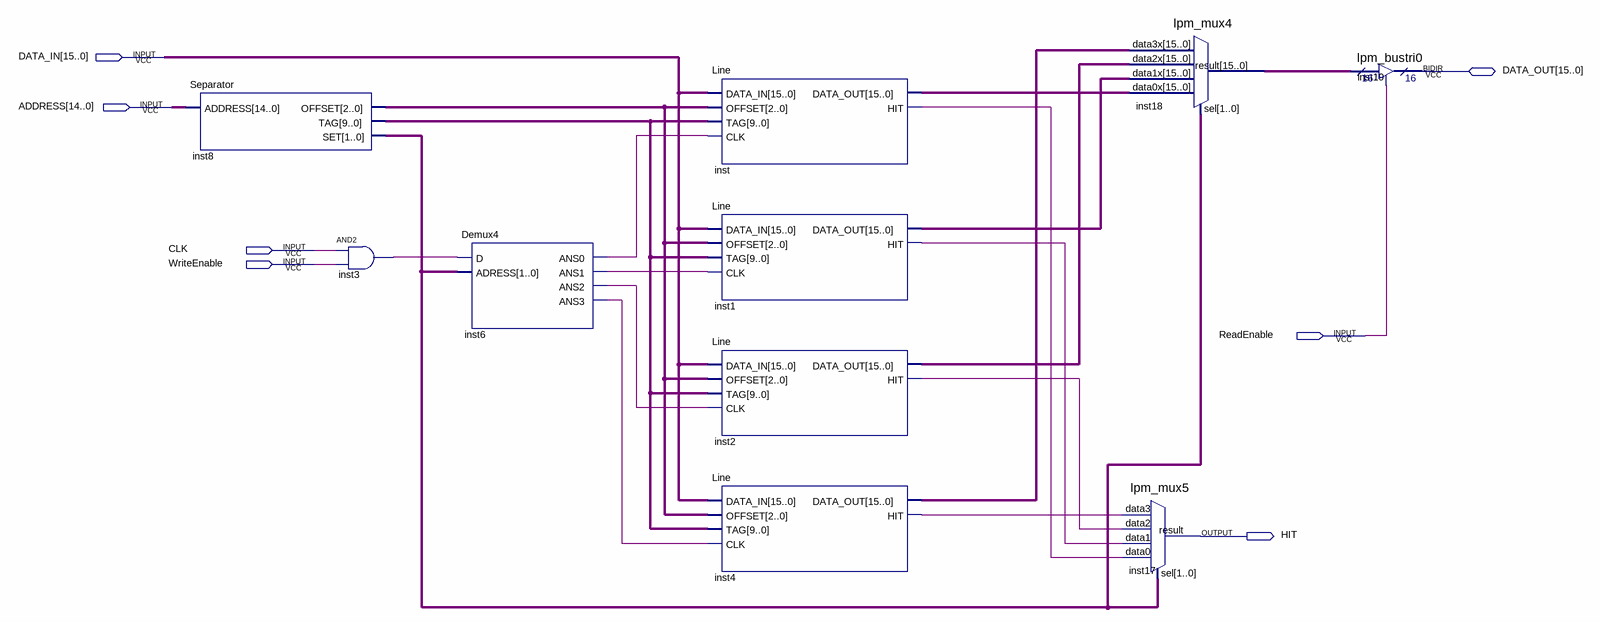
[diagram p0: schematic sheet]
// Quartus schematic Cache.bdf as structural Verilog: 10 symbols, 7 pins
module Cache (
  input  [15:0] DATA_IN,
  input  [14:0] ADDRESS,
  input  CLK,
  input  WriteEnable,
  input  ReadEnable,
  inout  [15:0] DATA_OUT,
  output HIT
);

  wire inst1_hit, inst2_hit, inst3_out, inst4_hit, inst6_ans0, inst6_ans1, inst6_ans2, inst6_ans3, inst_hit;
  wire [1:0] inst8_set;
  wire [2:0] inst8_offset;
  wire [9:0] inst8_tag;
  wire [15:0] inst1_data_out, inst2_data_out, inst4_data_out, inst18_result, inst_data_out;

  Separator inst8 (.ADDRESS(ADDRESS), .OFFSET(inst8_offset), .TAG(inst8_tag), .SET(inst8_set));
  and inst3 (inst3_out, CLK, WriteEnable);
  Demux4 inst6 (
    .D(inst3_out), .ADRESS(inst8_set), .ANS0(inst6_ans0), .ANS1(inst6_ans1), .ANS2(inst6_ans2),
    .ANS3(inst6_ans3));
  Line inst (
    .DATA_IN(DATA_IN), .OFFSET(inst8_offset), .TAG(inst8_tag), .CLK(inst6_ans0), .DATA_OUT(inst_data_out),
    .HIT(inst_hit));
  Line inst1 (
    .DATA_IN(DATA_IN), .OFFSET(inst8_offset), .TAG(inst8_tag), .CLK(inst6_ans1), .DATA_OUT(inst1_data_out),
    .HIT(inst1_hit));
  Line inst2 (
    .DATA_IN(DATA_IN), .OFFSET(inst8_offset), .TAG(inst8_tag), .CLK(inst6_ans2), .DATA_OUT(inst2_data_out),
    .HIT(inst2_hit));
  Line inst4 (
    .DATA_IN(DATA_IN), .OFFSET(inst8_offset), .TAG(inst8_tag), .CLK(inst6_ans3), .DATA_OUT(inst4_data_out),
    .HIT(inst4_hit));
  lpm_mux4 inst18 (
    .data3x(inst4_data_out), .data2x(inst2_data_out), .data1x(inst1_data_out), .data0x(inst_data_out),
    .sel(inst8_set), .result(inst18_result));
  lpm_mux5 inst17 (
    .data3(inst4_hit), .data2(inst2_hit), .data1(inst1_hit), .data0(inst_hit), .sel(inst8_set), .result(HIT));
  lpm_bustri0 inst19 (.enabledt(ReadEnable), .data(inst18_result), .tridata(DATA_OUT));
endmodule
